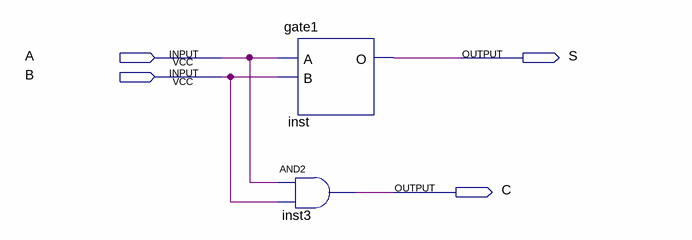
[diagram p0: schematic sheet]
// Quartus schematic halfAdder.bdf as structural Verilog: 2 symbols, 4 pins
module halfAdder (
  input  A,
  input  B,
  output S,
  output C
);

  gate1 inst (.A(A), .B(B), .O(S));
  and inst3 (C, A, B);
endmodule
